# Altium project Urukul.PrjPCB (part 10 of 11)

## Sheet LEDs.SchDoc: =DocumentName
size A4; DocumentNumber: 1; Revision: 0; SheetNumber: 5; SheetTotal: 20
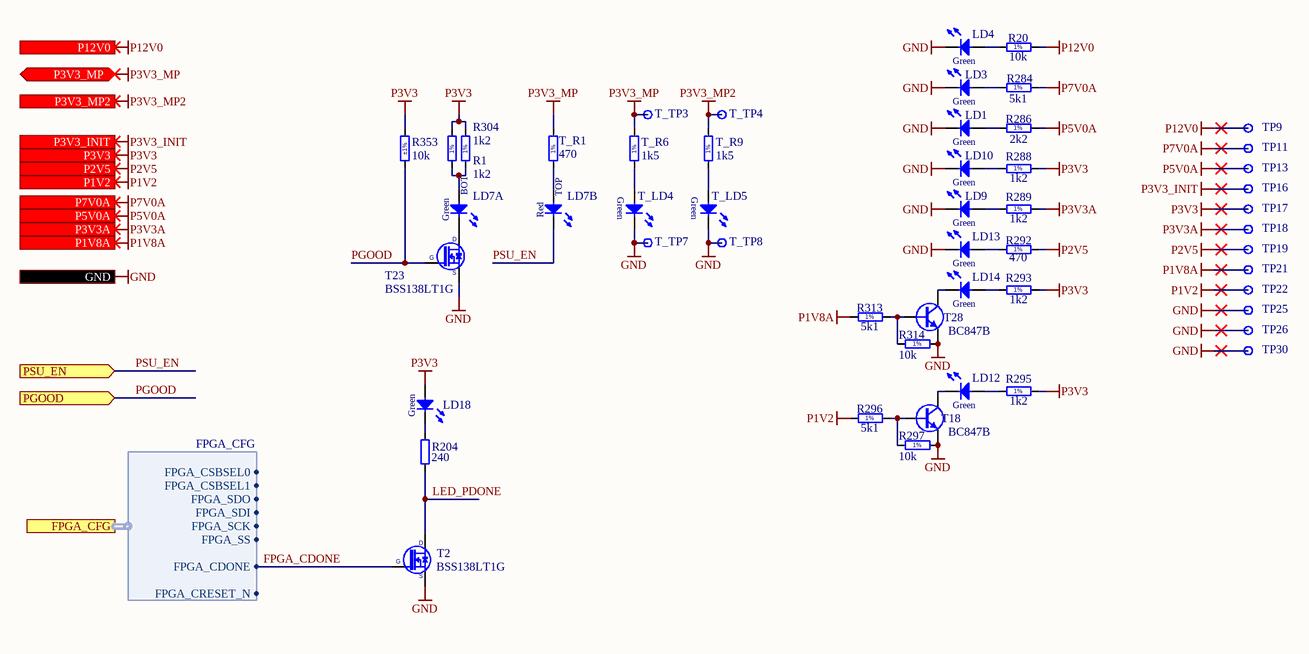
[diagram p19: LEDs.SchDoc]

### Parts
LD1  Green  [LED_KINGBRIGHT_KPH-1608CGCK]
LD3  Green  [LED_KINGBRIGHT_KPH-1608CGCK]
LD4  Green  [LED_KINGBRIGHT_KPH-1608CGCK]
LD7  Red/Green  [LED_DIALIGHT_571-0112F]  (value not drawn)  (parts A,B of 2)
LD9  Green  [LED_KINGBRIGHT_KPH-1608CGCK]
LD10  Green  [LED_KINGBRIGHT_KPH-1608CGCK]
LD12  Green  [LED_KINGBRIGHT_KPH-1608CGCK]
LD13  Green  [LED_KINGBRIGHT_KPH-1608CGCK]
LD14  Green  [LED_KINGBRIGHT_KPH-1608CGCK]
LD18  Green  [LED_AVAGO_HSME-C120]
R1  1k2  [RESC1608X55N]
R20  10k  [RESC1005X40N]
R204  240  [RESC1005X40N]
R284  5k1  [RESC1005X40N]
R286  2k2  [RESC1005X40N]
R288  1k2  [RESC1608X55N]
R289  1k2  [RESC1608X55N]
R292  470  [RESC1005X40N]
R293  1k2  [RESC1608X55N]
R295  1k2  [RESC1608X55N]
R296  5k1  [RESC1005X40N]
R297  10k  [RESC1005X40N]
R304  1k2  [RESC1608X55N]
R313  5k1  [RESC1005X40N]
R314  10k  [RESC1005X40N]
R353  10k  Tolerance: ±1%  [RESC1005X40N]
T2  BSS138LT1G  [SOT95P240X110-3N]
T18  BC847B  [SOT95P230X110-3N]
T23  BSS138LT1G  [SOT95P240X110-3N]
T28  BC847B  [SOT95P230X110-3N]
T_LD4  Green  [LED_KINGBRIGHT_KPH-1608CGCK]  (value not drawn)
T_LD5  Green  [LED_KINGBRIGHT_KPH-1608CGCK]  (value not drawn)
T_R1  470  [RESC1005X40N]
T_R6  1k5  [RESC1608X55N]
T_R9  1k5  [RESC1608X55N]
T_TP3  Test Point  [TPS127]  (value not drawn)  (no BOM)
T_TP4  Test Point  [TPS127]  (value not drawn)  (no BOM)
T_TP7  Test Point  [TPS127]  (value not drawn)  (no BOM)
T_TP8  Test Point  [TPS127]  (value not drawn)  (no BOM)
TP9  Test Point  [TPS127]  (value not drawn)  (no BOM)
TP11  Test Point  [TPS127]  (value not drawn)  (no BOM)
TP13  Test Point  [TPS127]  (value not drawn)  (no BOM)
TP16  Test Point  [TPS127]  (value not drawn)  (no BOM)
TP17  Test Point  [TPS127]  (value not drawn)  (no BOM)
TP18  Test Point  [TPS127]  (value not drawn)  (no BOM)
TP19  Test Point  [TPS127]  (value not drawn)  (no BOM)
TP21  Test Point  [TPS127]  (value not drawn)  (no BOM)
TP22  Test Point  [TPS127]  (value not drawn)  (no BOM)
TP25  Test Point  [TPS127]  (value not drawn)  (no BOM)
TP26  Test Point  [TPS127]  (value not drawn)  (no BOM)
TP30  Test Point  [TPS127]  (value not drawn)  (no BOM)

### Ports
FPGA_CFG (harness FPGA_CFG), GND, P1V2 (out), P1V8A (out), P2V5 (out), P3V3 (out), P3V3_INIT (out), P3V3_MP2 (in), P3V3_MP (bidir), P3V3A (out), P5V0A (out), P7V0A (out), P12V0 (in), PGOOD (in), PSU_EN (in)

### Harnesses
FPGA_CFG: FPGA_CSBSEL0, FPGA_CSBSEL1, FPGA_SDO, FPGA_SDI, FPGA_SCK, FPGA_SS, FPGA_CDONE, FPGA_CRESET_N

### Nets
GND: LD1.1(C) LD3.1(C) LD4.1(C) LD9.1(C) LD10.1(C) LD13.1(C) R297.2 R314.2 T2.2(S) T18.2(E) T23.2(S) T28.2(E) T_LD4.1(C) T_LD5.1(C) T_TP7.1 T_TP8.1 TP25.1 TP26.1 TP30.1 ; port GND
P1V2: R296.1 TP22.1 ; port P1V2
P1V8A: R313.1 TP21.1 ; port P1V8A
P2V5: R292.1 TP19.1 ; port P2V5
P3V3: LD18.2(A) R1.2 R288.2 R293.2 R295.2 R304.2 R353.2 TP17.1 ; port P3V3
P3V3_INIT: TP16.1 ; port P3V3_INIT
P3V3_MP: T_R1.1 T_R6.2 T_TP3.1 ; port P3V3_MP
P3V3_MP2: T_R9.2 T_TP4.1 ; port P3V3_MP2
P3V3A: R289.2 TP18.1 ; port P3V3A
P5V0A: R286.2 TP13.1 ; port P5V0A
P7V0A: R284.2 TP11.1 ; port P7V0A
P12V0: R20.2 TP9.1 ; port P12V0
FPGA_CDONE: T2.1(G) ; port FPGA_CFG.FPGA_CDONE
LED_PDONE: R204.1 T2.3(D)
PGOOD: R353.1 T23.1(G) ; port PGOOD  [project net INT_I2C_OE]
PSU_EN: LD7.3(C) ; port PSU_EN
NetLD1_2: LD1.2(A) R286.1
NetLD3_2: LD3.2(A) R284.1
NetLD4_2: LD4.2(A) R20.1
NetLD7_1: LD7.1(C) T23.3(D)
NetLD7_2: LD7.2(A) R1.1 R304.1
NetLD7_4: LD7.4(A) T_R1.2
NetLD9_2: LD9.2(A) R289.1
NetLD10_2: LD10.2(A) R288.1
NetLD12_1: LD12.1(C) T18.3(C)
NetLD12_2: LD12.2(A) R295.1
NetLD13_2: LD13.2(A) R292.2
NetLD14_1: LD14.1(C) T28.3(C)
NetLD14_2: LD14.2(A) R293.1
NetLD18_1: LD18.1(C) R204.2
NetR296_2: R296.2 R297.1 T18.1(B)
NetR313_2: R313.2 R314.1 T28.1(B)
NetT_LD4_2: T_LD4.2(A) T_R6.1
NetT_LD5_2: T_LD5.2(A) T_R9.1

### Notes on the sheet
- Filename:
- Project:
- SINARA
  LOGO
  TBD
- Originally released by:
- Last modified by:
- Last reviewed by:
- Size:
- Version:
- Last mod. date :
- Sheet:
- A4
- Copyright =P_copyright_owner
  This source describes Open Hardware and is licensed under the CERN-OHL-W v1. You may redistribute and modify this documentation and make products using it under the terms of the CERN-OHL-W v1 (https:/cern.ch/cern-ohl). This documentation is distributed WITHOUT ANY EXPRESS OR IMPLIED WARRANTY, INCLUDING OF MERCHANTABILITY, SATISFACTORY QUALITY AND FITNESS FOR A PARTICULAR PURPOSE. Please see the CERN-OHL-W v1 for applicable conditions.
  As per CERN-OHL-W 1 section 4.1, should You produce hardware based on these sources, You must maintain the Source Location visible on the external case of the product you make using this documentation.
  Source location: =P_github_link
- Sinara Opern Hardware:
- https://github.com/sinara-hw
- (in symbol LED_DIALIGHT_571-0112F, part A) BOT; Green
- (in symbol LED_DIALIGHT_571-0112F, part B) TOP; Red
- (in symbol R0402_2K2_1%_0.0625W_100PPM) 1%
- (in symbol R0402_5K1_1%_0.0625W_100PPM) 1%
- (in symbol R0402_10K_1%_0.0625W_100PPM) 1%
- (in symbol R0402_470R_1%_0.0625W_100PPM) 1%
- (in symbol R0603_1K2_1%_0.1W_100PPM) 1%
- (in symbol R0603_1K5_1%_0.1W_100PPM) 1%

### Library data of the parts
LD1 LD3 LD4 LD9 LD10 LD12-LD14 T_LD4 T_LD5 = LED_KINGBRIGHT_KPH-1608CGCK: LED Green 1C 2A; Part Description: SMD Green LED, Case 1.6mmX0.8mm(0603), 0.65mm Thickness; PressFit: No; Bonding: No; Part Number: LED_KINGBRIGHT_KPH-1608CGCK; Component Kind: Standard; Component Type: Standard; Color: Green; PackageDescription: SMT Green LED, Case 0603, Body L 1.6 x W 0.8mm H 0.65mm; Manufacturer: KINGBRIGHT; Manufacturer Part Number: KPH-1608CGCK; Pin Count: 2; Mounted: Yes; Socket: No; SMD: Yes; Sense: No; ComponentHeight: 0.65mm; HelpURL: \\cern.ch\dfs\Applications\Altium\Datasheets\LED_KINGBRIGHT_KPH-1608CGCK.pdf; Author: CERN DEM JLC
  LD1 LD3 LD4 LD9 LD10 LD12-LD14: CreateDate: 03/07/2017; LatestRevisionDate: 03/07/2017
  T_LD4 T_LD5: CreateDate: 03.07.2017; LatestRevisionDate: 03.07.2017
LD7 = LED_DIALIGHT_571-0112F: 2x LED  Botom Green, Top Red; Part Description: Dual 2mm  LEDs, Red Top,Green Bot, CBI® Circuit Board Indicator (Without positioning pins); PressFit: No; Bonding: No; Part Number: LED_DIALIGHT_571-0112F; Component Kind: Standard; Component Type: Standard; Color: Red/Green; PackageDescription: 2x 2mm LED (Top: Red, Bot: Green) PCB Edge Mounting (Without positioning pins) DIALIGHT 571 Serie; Manufacturer: DIALIGHT; Manufacturer Part Number: 571-0112F; Pin Count: 4; Mounted: Yes; Socket: No; SMD: No; Sense: No; ComponentHeight: 8.6mm; HelpURL: \\cern.ch\dfs\Applications\Altium\Datasheets\LED_DIALIGHT_571-0112F.pdf; Author: CERN DEM JLC; CreateDate: 09.11.2009; LatestRevisionDate: 17.03.2010
LD18 = LED_AVAGO_HSME-C120: LED Green 1C 2A; Part Description: High Performance Right Angle Chip Green LED; Manufacturer: AVAGO TECHNOLOGIES; PressFit: No; Bonding: No; Part Number: LED_AVAGO_HSME-C120; Component Kind: Standard; Component Type: Standard; Color: Green; PackageDescription: Green Chip LED, 2-Leads, Body 1.7x1.1mm, Side Emitting Package; Manufacturer Part Number: HSME-C120; Pin Count: 2; Mounted: Yes; Socket: No; SMD: Yes; Sense: No; ComponentHeight: 0.7mm; HelpURL: \\cern.ch\dfs\Applications\Altium\Datasheets\LED_AVAGO_HSME-C120.pdf; ComponentLink1URL: \\cern.ch\dfs\Applications\Altium\Datasheets\LED_AVAGO_HSME-C110_DESIGN-GUIDE.pdf; ComponentLink1Description: Design Guide; Author: CERN DEM JMW; CreateDate: 22.07.2009; LatestRevisionDate: 20.06.2012
R1 R288 R289 R293 R295 R304 = R0603_1K2_1%_0.1W_100PPM: as R130 on sheet Power_main_DCDC; Part Number: R0603_1K2_1%_0.1W_100PPM; Component Kind: Standard; Component Type: Standard; Pin Count: 2; Value: 1k2; Status: Preferred; Tolerance: ±1%; Manufacturer Part Number: R0603_1K2_1%_0.1W_100PPM; Case: 0603; Mounted: Yes; Sense: No; Socket: No; SMD: Yes; Manufacturer1 Example: NIC COMPONENT; Manufacturer1 ComponentHeight: 0.55mm; HelpURL: \\cern.ch\dfs\Applications\Altium\Datasheets\R0603_NIC_NRC.pdf; Author: CERN DEM JLC; CreateDate: 03.12.2007; LatestRevisionDate: 13.03.2008
R20 R297 R314 R353 = R0402_10K_1%_0.0625W_100PPM: as T_R31-T_R34 on sheet Power-up_delay; Part Number: R0402_10K_1%_0.0625W_100PPM; Component Kind: Standard; Component Type: Standard; Pin Count: 2; Value: 10k; Status: Not Recommended; Power: 0.0625W; Manufacturer Part Number: R0402_10K_1%_0.0625W_100PPM; Case: 0402; Mounted: Yes; Sense: No; Socket: No; SMD: Yes; Manufacturer1 Example: YAGEO PHYCOMP; Manufacturer1 ComponentHeight: 0.4mm; HelpURL: \\cern.ch\dfs\Applications\Altium\Datasheets\R0402_Phycomp_RC0402.pdf; Author: CERN DEM JLC; CreateDate: 03.12.2007; LatestRevisionDate: 17.10.2012
  R20 R297 R314: Tolerance: ±1%
R204 = R0402_240R_1%_0.0625W_100PPM: as R87 on sheet Power_main_DCDC; Part Number: R0402_240R_1%_0.0625W_100PPM; Component Kind: Standard; Component Type: Standard; Pin Count: 2; Value: 240; Status: Not Recommended; Power: 0.0625W; Tolerance: ±1%; Manufacturer Part Number: R0402_240R_1%_0.0625W_100PPM; Case: 0402; Mounted: Yes; Sense: No; Socket: No; SMD: Yes; Manufacturer1 Example: YAGEO PHYCOMP; Manufacturer1 ComponentHeight: 0.4mm; HelpURL: \\cern.ch\dfs\Applications\Altium\Datasheets\R0402_Phycomp_RC0402.pdf; Author: CERN DEM JLC; CreateDate: 03.12.2007; LatestRevisionDate: 17.10.2012
R284 R296 R313 = R0402_5K1_1%_0.0625W_100PPM: as R51 on sheet Power_main_DCDC; Part Number: R0402_5K1_1%_0.0625W_100PPM; Component Kind: Standard; Component Type: Standard; Pin Count: 2; Value: 5k1; Status: Not Recommended; Power: 0.0625W; Tolerance: ±1%; Manufacturer Part Number: R0402_5K1_1%_0.0625W_100PPM; Case: 0402; Mounted: Yes; Sense: No; Socket: No; SMD: Yes; Manufacturer1 Example: YAGEO PHYCOMP; Manufacturer1 ComponentHeight: 0.4mm; HelpURL: \\cern.ch\dfs\Applications\Altium\Datasheets\R0402_Phycomp_RC0402.pdf; Author: CERN DEM JLC; CreateDate: 03.12.2007; LatestRevisionDate: 17.10.2012
R286 = R0402_2K2_1%_0.0625W_100PPM: as R132 on sheet Power_main_DCDC; Part Number: R0402_2K2_1%_0.0625W_100PPM; Component Kind: Standard; Component Type: Standard; Pin Count: 2; Value: 2k2; Status: Not recommended; Power: 0.0625W; Tolerance: ±1%; Manufacturer Part Number: R0402_2K2_1%_0.0625W_100PPM; Case: 0402; Mounted: Yes; Socket: No; SMD: Yes; Manufacturer1 Example: YAGEO PHYCOMP; Manufacturer1 ComponentHeight: 0.4mm; HelpURL: \\cern.ch\dfs\Applications\Altium\Datasheets\R0402_Phycomp_RC0402.pdf; Author: CERN DEM JLC; CreateDate: 2007-12-03; LatestRevisionDate: 2012-10-17
R292 T_R1 = R0402_470R_1%_0.0625W_100PPM: Resistor - 1%; Part Description: General Purpose Thick Film Chip Resistor; Manufacturer: GENERIC; Manufacturer1 Part Number: 232270674701L; TC: ±100ppm/°C; PressFit: No; Part Number: R0402_470R_1%_0.0625W_100PPM; Component Kind: Standard; Component Type: Standard; Pin Count: 2; Value: 470; Status: Not Recommended; Power: 0.0625W; Tolerance: ±1%; Manufacturer Part Number: R0402_470R_1%_0.0625W_100PPM; Case: 0402; Mounted: Yes; Sense: No; Socket: No; SMD: Yes; Manufacturer1 Example: YAGEO PHYCOMP; Manufacturer1 ComponentHeight: 0.4mm; HelpURL: \\cern.ch\dfs\Applications\Altium\Datasheets\R0402_Phycomp_RC0402.pdf; Author: CERN DEM JLC; CreateDate: 03.12.2007; LatestRevisionDate: 17.10.2012
T2 = BSS138LT1G: as T3 on sheet Power_main_DCDC; Part Number: BSS138LT1G; Component Kind: Standard; Component Type: Standard; Device: BSS138LT1G; PackageDescription: SOT23 3-Leads, Pitch 0.95mm - Body 1.4x3mm, IPC Medium Density; Manufacturer Part Number: BSS138LT1G; Pin Count: 3; Case: SOT23-3; Mounted: Yes; Socket: No; SMD: Yes; Sense: No; ComponentHeight: 1.11mm; HelpURL: \\cern.ch\dfs\Applications\Altium\Datasheets\BSS138LT1G.pdf; Author: CERN DEM JLC; CreateDate: 23.03.2009; LatestRevisionDate: 23.03.2009
T18 T28 = BC847B: as T13 on sheet Power_main_DCDC; Part Number: BC847B; Component Kind: Standard; Component Type: Standard; Device: BC847B; PackageDescription: SOT23, 3 pin, Pitch 0.95mm - 1.3mm W X 2.9mm L X 1.1mm H, IPC Medium Density; Manufacturer Part Number: BC847B; Pin Count: 3; Case: SOT23-3; Mounted: Yes; Socket: No; SMD: Yes; Sense: No; ComponentHeight: 1.1mm; HelpURL: \\cern.ch\dfs\Applications\Altium\Datasheets\BC847B.pdf; Author: CERN DEM JLC; CreateDate: 14.06.2011; LatestRevisionDate: 14.06.2011
T23 = BSS138LT1G: as T_T2-T_T5 on sheet Power-up_delay; Part Number: BSS138LT1G; Component Kind: Standard; Component Type: Standard; Device: BSS138LT1G; PackageDescription: SOT23, 0.95mm Pitch; 3 Pin, 1.40mm W X 3.00mm L X 1.10mm H body, IPC Medium Density; Manufacturer Part Number: BSS138L; Pin Count: 3; Case: SOT23-3; Mounted: Yes; Socket: No; SMD: Yes; Sense: No; ComponentHeight: 1.11mm; HelpURL: \\cern.ch\dfs\Applications\Altium\Datasheets\BSS138LT1G.pdf; Author: CERN DEM JLC; CreateDate: 23.03.2009; LatestRevisionDate: 25.05.2022
T_R6 T_R9 = R0603_1K5_1%_0.1W_100PPM: as R80 on sheet Power_main_DCDC; Part Number: R0603_1K5_1%_0.1W_100PPM; Component Kind: Standard; Component Type: Standard; Pin Count: 2; Value: 1k5; Status: Preferred; Tolerance: ±1%; Manufacturer Part Number: R0603_1K5_1%_0.1W_100PPM; Case: 0603; Mounted: Yes; Sense: No; Socket: No; SMD: Yes; Manufacturer1 Example: NIC COMPONENT; Manufacturer1 ComponentHeight: 0.55mm; HelpURL: \\cern.ch\dfs\Applications\Altium\Datasheets\R0603_NIC_NRC.pdf; Author: CERN DEM JLC; CreateDate: 03.12.2007; LatestRevisionDate: 13.03.2008
T_TP3 T_TP4 T_TP7 T_TP8 TP9 TP11 TP13 TP16-TP19 TP21 TP22 TP25 TP26 TP30 = SMD_PAD_1.27X1.27MM: as TP5-TP8 on sheet Power_main_DCDC; Part Number: SMD_PAD_1.27X1.27MM; Component Type: Standard (No BOM); Pin Count: 1; Family: Test Point; Socket: No; SMD: Yes; Sense: No; Status: None; ComponentHeight: 0mm; HelpURL: Undefined; Author: CERN DEM JLC; CreateDate: 12.01.2008; LatestRevisionDate: 12.01.2008; PackageDescription: 1.27mm x 1.27mm PCB Copper Area (SMD Test Point)

## Nets that join several sheets
GND: CPCIS_Connectors_P1_P6 (55 pins), DIOT_signal_routing (T_C22.1 T_C23.1 T_IC8.4), EEM_Connectors (34 pins), Temperature_monitoring (5 pins), Mechanical (34 pins), FP_Connectors (52 pins), CLK_INPUT (68 pins), Urukul_FPGA_Supply (43 pins), U_DDS_OUT_channel0 (60 pins), U_DDS_OUT_channel1 (60 pins), U_DDS_OUT_channel2 (60 pins), U_DDS_OUT_channel3 (60 pins), U_DDS_channel0 (112 pins), U_DDS_channel1 (112 pins), U_DDS_channel2 (112 pins), U_DDS_channel3 (112 pins), Urukul_FPGA (10 pins), CLK_SYNC (19 pins), Urukul_FPGA_Config (24 pins), Urukul_FPGA_LVDS (T16.2), I2C_switch (6 pins), Power_Supplies (T_C1.1 T_C2.2 T_IC1.2 T_R7.1), Power-up_delay (9 pins), Power_main_DCDC (100 pins), LEDs (19 pins)
P1V2: Urukul_FPGA_Supply (16 pins), Power_main_DCDC (5 pins), LEDs (R296.1 TP22.1)
P1V8A: CLK_INPUT (R151.1 R164.1), U_DDS_channel0 (6 pins), U_DDS_channel1 (6 pins), U_DDS_channel2 (6 pins), U_DDS_channel3 (6 pins), CLK_SYNC (R150.1), Power_main_DCDC (6 pins), LEDs (R313.1 TP21.1)
P2V5: Urukul_FPGA_Supply (11 pins), Power_main_DCDC (5 pins), LEDs (R292.1 TP19.1)
P3V3: Urukul_FPGA_Supply (22 pins), Urukul_FPGA (12 pins), CLK_SYNC (L8.2 L13.2), Urukul_FPGA_Config (T_R90.2 T_R91.2 T_R92.2 T_R93.2), Urukul_FPGA_LVDS (LD19.2), I2C_switch (8 pins), Power_main_DCDC (8 pins), LEDs (8 pins)
P3V3_INIT: Urukul_FPGA_Supply (C5.2 U1.N13), Power_main_DCDC (6 pins), LEDs (TP16.1)
P3V3_MP: DIOT_signal_routing (T_C22.2 T_C23.2 T_IC8.1 T_IC8.8), EEM_Connectors (5 pins), Temperature_monitoring (T_C8.2 T_IC6.8), Urukul_FPGA_Config (14 pins), I2C_switch (T_C24.2 T_IC9.8), Power_Supplies (T_R2.2 T_R8.2), Power-up_delay (6 pins), LEDs (T_R1.1 T_R6.2 T_TP3.1)
P3V3_MP2: EEM_Connectors (5 pins), I2C_switch (T_C9.2 T_IC16.8), LEDs (T_R9.2 T_TP4.1)
P3V3A: CLK_INPUT (L10.2 L14.2 R16.1 T1.2), U_DDS_channel0 (L15A.2 L18A.2), U_DDS_channel1 (L15B.2 L18B.2), U_DDS_channel2 (L15C.2 L18C.2), U_DDS_channel3 (L15D.2 L18D.2), Power_main_DCDC (6 pins), LEDs (R289.2 TP18.1)
P5V0A: U_DDS_OUT_channel0 (L6A.2 L7A.1), U_DDS_OUT_channel1 (L6B.2 L7B.1), U_DDS_OUT_channel2 (L6C.2 L7C.1), U_DDS_OUT_channel3 (L6D.2 L7D.1), Power_main_DCDC (6 pins), LEDs (R286.2 TP13.1)
P7V0A: U_DDS_OUT_channel0 (C12A.2 C27A.2 R137A.1), U_DDS_OUT_channel1 (C12B.2 C27B.2 R137B.1), U_DDS_OUT_channel2 (C12C.2 C27C.2 R137C.1), U_DDS_OUT_channel3 (C12D.2 C27D.2 R137D.1), Power_main_DCDC (7 pins), LEDs (R284.2 TP11.1)
P12V0: CPCIS_Connectors_P1_P6 (7 pins), EEM_Connectors (T_J1.28 T_J1.29 T_J2.28 T_J2.29), Power_Supplies (T_C1.2 T_IC1.1 T_R4.1), Power-up_delay (T_R29.1), Power_main_DCDC (13 pins), LEDs (R20.2 TP9.1)
AFE_PWR_EN: Urukul_FPGA (U1.H16), Power_main_DCDC (R282.1)
ATT_CLK: U_DDS_OUT_channel0 (IC3A.21), U_DDS_OUT_channel1 (IC3B.21), U_DDS_OUT_channel2 (IC3C.21), U_DDS_OUT_channel3 (IC3D.21), Urukul_FPGA (U1.B3)
ATT_LE0: U_DDS_OUT_channel0 (IC3A.22), Urukul_FPGA (U1.D13)
ATT_LE1: U_DDS_OUT_channel1 (IC3B.22), Urukul_FPGA (U1.C11)
ATT_LE2: U_DDS_OUT_channel2 (IC3C.22), Urukul_FPGA (U1.D4)
ATT_LE3: U_DDS_OUT_channel3 (IC3D.22), Urukul_FPGA (U1.A2)
ATT_RSTn: U_DDS_OUT_channel0 (IC3A.20), U_DDS_OUT_channel1 (IC3B.20), U_DDS_OUT_channel2 (IC3C.20), U_DDS_OUT_channel3 (IC3D.20), Urukul_FPGA (U1.D8)
ATT_S_IN0: U_DDS_OUT_channel0 (IC3A.24), Urukul_FPGA (U1.C13)
ATT_S_IN1: U_DDS_OUT_channel1 (IC3B.24), Urukul_FPGA (U1.C12)
ATT_S_IN2: U_DDS_OUT_channel2 (IC3C.24), Urukul_FPGA (U1.C5)
ATT_S_IN3: U_DDS_OUT_channel3 (IC3D.24), Urukul_FPGA (U1.A1)
ATT_S_OUT0: U_DDS_OUT_channel0 (R100A.1), Urukul_FPGA (U1.C14)
ATT_S_OUT1: U_DDS_OUT_channel1 (R100B.1), Urukul_FPGA (U1.E11)
ATT_S_OUT2: U_DDS_OUT_channel2 (R100C.1), Urukul_FPGA (U1.C4)
ATT_S_OUT3: U_DDS_OUT_channel3 (R100D.1), Urukul_FPGA (U1.F9)
BP_CLK.CLK_N: CPCIS_Connectors_P1_P6 (T_J4.F4), CLK_INPUT (R86.1)
BP_CLK.CLK_P: CPCIS_Connectors_P1_P6 (T_J4.E4), CLK_INPUT (R66.1)
BP_I2C.SCL: CPCIS_Connectors_P1_P6 (T_D2.3 T_J4.B2), DIOT_signal_routing (T_IC8.6)
BP_I2C.SDA: CPCIS_Connectors_P1_P6 (T_D2.1 T_J4.C2), DIOT_signal_routing (T_IC8.7)
BP_IO.LVDS_N0: CPCIS_Connectors_P1_P6 (T_J4.E3), DIOT_signal_routing (T_R51.1)
BP_IO.LVDS_N1: CPCIS_Connectors_P1_P6 (T_J4.B3), DIOT_signal_routing (T_R52.1)
BP_IO.LVDS_N2: CPCIS_Connectors_P1_P6 (T_J4.C4), DIOT_signal_routing (T_R53.1)
BP_IO.LVDS_N3: CPCIS_Connectors_P1_P6 (T_J4.L4), DIOT_signal_routing (T_R54.1)
BP_IO.LVDS_N4: CPCIS_Connectors_P1_P6 (T_J4.I4), DIOT_signal_routing (T_R55.1)
BP_IO.LVDS_N5: CPCIS_Connectors_P1_P6 (T_J4.K5), DIOT_signal_routing (T_R56.1)
BP_IO.LVDS_N6: CPCIS_Connectors_P1_P6 (T_J4.H5), DIOT_signal_routing (T_R57.1)
BP_IO.LVDS_N7: CPCIS_Connectors_P1_P6 (T_J4.F6), DIOT_signal_routing (T_R58.1)
BP_IO.LVDS_N8: CPCIS_Connectors_P1_P6 (T_J4.C6), DIOT_signal_routing (T_R59.1)
BP_IO.LVDS_N9: CPCIS_Connectors_P1_P6 (T_J4.L6), DIOT_signal_routing (T_R60.1)
BP_IO.LVDS_N10: CPCIS_Connectors_P1_P6 (T_J4.I6), DIOT_signal_routing (T_R61.1)
BP_IO.LVDS_N11: CPCIS_Connectors_P1_P6 (T_J5.E1), DIOT_signal_routing (T_R62.1)
BP_IO.LVDS_N12: CPCIS_Connectors_P1_P6 (T_J5.B1), DIOT_signal_routing (T_R63.1)
BP_IO.LVDS_N13: CPCIS_Connectors_P1_P6 (T_J5.K1), DIOT_signal_routing (T_R64.1)
BP_IO.LVDS_N14: CPCIS_Connectors_P1_P6 (T_J5.H1), DIOT_signal_routing (T_R65.1)
BP_IO.LVDS_N15: CPCIS_Connectors_P1_P6 (T_J4.F2), DIOT_signal_routing (T_R66.2)
BP_IO.LVDS_P0: CPCIS_Connectors_P1_P6 (T_J4.D3), DIOT_signal_routing (T_R35.1)
BP_IO.LVDS_P1: CPCIS_Connectors_P1_P6 (T_J4.A3), DIOT_signal_routing (T_R36.1)
BP_IO.LVDS_P2: CPCIS_Connectors_P1_P6 (T_J4.B4), DIOT_signal_routing (T_R37.1)
BP_IO.LVDS_P3: CPCIS_Connectors_P1_P6 (T_J4.K4), DIOT_signal_routing (T_R38.1)
BP_IO.LVDS_P4: CPCIS_Connectors_P1_P6 (T_J4.H4), DIOT_signal_routing (T_R39.1)
BP_IO.LVDS_P5: CPCIS_Connectors_P1_P6 (T_J4.J5), DIOT_signal_routing (T_R40.1)
BP_IO.LVDS_P6: CPCIS_Connectors_P1_P6 (T_J4.G5), DIOT_signal_routing (T_R41.1)
BP_IO.LVDS_P7: CPCIS_Connectors_P1_P6 (T_J4.E6), DIOT_signal_routing (T_R42.1)
BP_IO.LVDS_P8: CPCIS_Connectors_P1_P6 (T_J4.B6), DIOT_signal_routing (T_R43.1)
BP_IO.LVDS_P9: CPCIS_Connectors_P1_P6 (T_J4.K6), DIOT_signal_routing (T_R44.1)
BP_IO.LVDS_P10: CPCIS_Connectors_P1_P6 (T_J4.H6), DIOT_signal_routing (T_R45.1)
BP_IO.LVDS_P11: CPCIS_Connectors_P1_P6 (T_J5.D1), DIOT_signal_routing (T_R46.1)
BP_IO.LVDS_P12: CPCIS_Connectors_P1_P6 (T_J5.A1), DIOT_signal_routing (T_R47.1)
BP_IO.LVDS_P13: CPCIS_Connectors_P1_P6 (T_J5.J1), DIOT_signal_routing (T_R48.1)
BP_IO.LVDS_P14: CPCIS_Connectors_P1_P6 (T_J5.G1), DIOT_signal_routing (T_R49.1)
BP_IO.LVDS_P15: CPCIS_Connectors_P1_P6 (T_J4.E2), DIOT_signal_routing (T_R50.2)
CK_SMA_IN: FP_Connectors (J2.1), CLK_INPUT (C196.1)
CLK_DIV: CLK_INPUT (R155.1), Urukul_FPGA (U1.P6)
CLK_DRTIO: CLK_INPUT (TR9.3), Urukul_FPGA (R67.2 U1.R9)
CSN: U_DDS_channel0 (IC2A.70 IC13A.61), Urukul_FPGA (U1.B10)
CSN: U_DDS_channel1 (IC2B.70 IC13B.61), Urukul_FPGA (U1.M15)
CSN: U_DDS_channel2 (IC2C.70 IC13C.61), Urukul_FPGA (U1.D6)
CSN: U_DDS_channel3 (IC2D.70 IC13D.61), Urukul_FPGA (U1.R15)
DAC_OUT_N: U_DDS_OUT_channel0 (R8A.1 R38A.1 TR1A.4 TR8A.3), U_DDS_channel0 (R78A.2 R91A.2)
DAC_OUT_N: U_DDS_OUT_channel1 (R8B.1 R38B.1 TR1B.4 TR8B.3), U_DDS_channel1 (R78B.2 R91B.2)
DAC_OUT_N: U_DDS_OUT_channel2 (R8C.1 R38C.1 TR1C.4 TR8C.3), U_DDS_channel2 (R78C.2 R91C.2)
DAC_OUT_N: U_DDS_OUT_channel3 (R8D.1 R38D.1 TR1D.4 TR8D.3), U_DDS_channel3 (R78D.2 R91D.2)
DAC_OUT_P: U_DDS_OUT_channel0 (R8A.2 R54A.1 TR1A.6 TR8A.1), U_DDS_channel0 (R56A.2 R79A.2)
DAC_OUT_P: U_DDS_OUT_channel1 (R8B.2 R54B.1 TR1B.6 TR8B.1), U_DDS_channel1 (R56B.2 R79B.2)
DAC_OUT_P: U_DDS_OUT_channel2 (R8C.2 R54C.1 TR1C.6 TR8C.1), U_DDS_channel2 (R56C.2 R79C.2)
DAC_OUT_P: U_DDS_OUT_channel3 (R8D.2 R54D.1 TR1D.6 TR8D.1), U_DDS_channel3 (R56D.2 R79D.2)
DDS_CLK_N: CLK_INPUT (C58.1), U_DDS_channel3 (IC13D.28 R12D.2)
DDS_CLK_N: CLK_INPUT (C60.1), U_DDS_channel2 (IC13C.28 R12C.2)
DDS_CLK_N: CLK_INPUT (C88.1), U_DDS_channel1 (IC13B.28 R12B.2)
DDS_CLK_N: CLK_INPUT (C93.1), U_DDS_channel0 (IC13A.28 R12A.2)
DDS_CLK_P: CLK_INPUT (C57.1), U_DDS_channel3 (IC13D.27 R12D.1)
DDS_CLK_P: CLK_INPUT (C59.1), U_DDS_channel2 (IC13C.27 R12C.1)
DDS_CLK_P: CLK_INPUT (C62.1), U_DDS_channel1 (IC13B.27 R12B.1)
DDS_CLK_P: CLK_INPUT (C92.1), U_DDS_channel0 (IC13A.27 R12A.1)
DDS_CLKB_N: CLK_INPUT (C61.1), U_DDS_channel1 (IC2B.91 R10B.2)
DDS_CLKB_N: CLK_INPUT (C66.1), U_DDS_channel0 (IC2A.91 R10A.2)
DDS_CLKB_N: CLK_INPUT (C71.1), U_DDS_channel2 (IC2C.91 R10C.2)
DDS_CLKB_N: CLK_INPUT (C96.1), U_DDS_channel3 (IC2D.91 R10D.2)
DDS_CLKB_P: CLK_INPUT (C56.1), U_DDS_channel1 (IC2B.90 R10B.1)
DDS_CLKB_P: CLK_INPUT (C65.1), U_DDS_channel0 (IC2A.90 R10A.1)
DDS_CLKB_P: CLK_INPUT (C68.1), U_DDS_channel2 (IC2C.90 R10C.1)
DDS_CLKB_P: CLK_INPUT (C95.1), U_DDS_channel3 (IC2D.90 R10D.1)
DDS_I/O_RESET: U_DDS_channel0 (IC2A.71), U_DDS_channel1 (IC2B.71), U_DDS_channel2 (IC2C.71), U_DDS_channel3 (IC2D.71), Urukul_FPGA (U1.E14)
DDS_PLL_LOCK0: U_DDS_channel0 (IC2A.19), Urukul_FPGA (U1.E5)
DDS_PLL_LOCK1: U_DDS_channel1 (IC2B.19), Urukul_FPGA (U1.C10)
DDS_PLL_LOCK2: U_DDS_channel2 (IC2C.19), Urukul_FPGA (U1.P4)
DDS_PLL_LOCK3: U_DDS_channel3 (IC2D.19), Urukul_FPGA (U1.P16)
DDS_Profile.P00: U_DDS_channel0 (IC2A.54), Urukul_FPGA (U1.A15)
DDS_Profile.P01: U_DDS_channel1 (IC2B.54), Urukul_FPGA (U1.J14)
DDS_Profile.P02: U_DDS_channel2 (IC2C.54), Urukul_FPGA (U1.E9)
DDS_Profile.P03: U_DDS_channel3 (IC2D.54), Urukul_FPGA (U1.L12)
DDS_Profile.P10: U_DDS_channel0 (IC2A.53), Urukul_FPGA (U1.B13)
DDS_Profile.P11: U_DDS_channel1 (IC2B.53), Urukul_FPGA (U1.K14)
DDS_Profile.P12: U_DDS_channel2 (IC2C.53), Urukul_FPGA (U1.E6)
DDS_Profile.P13: U_DDS_channel3 (IC2D.53), Urukul_FPGA (U1.M13)
DDS_Profile.P20: U_DDS_channel0 (IC2A.52), Urukul_FPGA (U1.B14)
DDS_Profile.P21: U_DDS_channel1 (IC2B.52), Urukul_FPGA (U1.J10)
DDS_Profile.P22: U_DDS_channel2 (IC2C.52), Urukul_FPGA (U1.D7)
DDS_Profile.P23: U_DDS_channel3 (IC2D.52), Urukul_FPGA (U1.R14)
DDS_RESET0: U_DDS_channel0 (IC13A.59), Urukul_FPGA (R111.1)
DDS_RESET1: U_DDS_channel1 (IC13B.59), Urukul_FPGA (R115.1)
DDS_RESET2: U_DDS_channel2 (IC13C.59), Urukul_FPGA (R116.1)
DDS_RESET3: U_DDS_channel3 (IC13D.59), Urukul_FPGA (R139.1)
DDS_SCKI0: U_DDS_channel0 (IC2A.69 IC13A.64 R40A.2), Urukul_FPGA (U1.B8)
DDS_SCKI1: U_DDS_channel1 (IC2B.69 IC13B.64 R40B.2), Urukul_FPGA (U1.G11)
DDS_SCKI2: U_DDS_channel2 (IC2C.69 IC13C.64 R40C.2), Urukul_FPGA (U1.C3)
DDS_SCKI3: U_DDS_channel3 (IC2D.69 IC13D.64 R40D.2), Urukul_FPGA (U1.K13)
DDS_SDI0: U_DDS_channel0 (IC2A.67 IC13A.63 R41A.2), Urukul_FPGA (U1.A10)
DDS_SDI1: U_DDS_channel1 (IC2B.67 IC13B.63 R41B.2), Urukul_FPGA (U1.M16)
DDS_SDI2: U_DDS_channel2 (IC2C.67 IC13C.63 R41C.2), Urukul_FPGA (U1.A5)
DDS_SDI3: U_DDS_channel3 (IC2D.67 IC13D.63 R41D.2), Urukul_FPGA (U1.L14)
DDS_SDO0: U_DDS_channel0 (IC2A.68 IC13A.62), Urukul_FPGA (U1.A11)
DDS_SDO1: U_DDS_channel1 (IC2B.68 IC13B.62), Urukul_FPGA (U1.N16)
DDS_SDO2: U_DDS_channel2 (IC2C.68 IC13C.62), Urukul_FPGA (U1.D5)
DDS_SDO3: U_DDS_channel3 (IC2D.68 IC13D.62), Urukul_FPGA (U1.L13)
DDS_SYNC_CLK0: U_DDS_channel0 (IC2A.55), Urukul_FPGA (U1.B4), CLK_SYNC (R31.1)
DDS_SYNC_CLK_OUTEN: Urukul_FPGA (U1.N6), CLK_SYNC (IC4.3)
DDS_SYNC_CLKSEL: Urukul_FPGA (U1.N5), CLK_SYNC (R152.1)
DDS_SYNC_IN_N0: U_DDS_channel0 (IC2A.8), CLK_SYNC (IC9.4)
DDS_SYNC_IN_N1: U_DDS_channel1 (IC2B.8), CLK_SYNC (IC9.31)
DDS_SYNC_IN_N2: U_DDS_channel2 (IC2C.8), CLK_SYNC (IC9.25)
DDS_SYNC_IN_N3: U_DDS_channel3 (IC2D.8), CLK_SYNC (IC9.27)
DDS_SYNC_IN_P0: U_DDS_channel0 (IC2A.7), CLK_SYNC (IC9.5)
DDS_SYNC_IN_P1: U_DDS_channel1 (IC2B.7), CLK_SYNC (IC9.32)
DDS_SYNC_IN_P2: U_DDS_channel2 (IC2C.7), CLK_SYNC (IC9.26)
DDS_SYNC_IN_P3: U_DDS_channel3 (IC2D.7), CLK_SYNC (IC9.28)
DDS_SYNC_OUT_N0: U_DDS_channel0 (IC2A.10), CLK_SYNC (IC9.15 R68.2)
DDS_SYNC_OUT_P0: U_DDS_channel0 (IC2A.9), CLK_SYNC (IC9.14 R68.1)
DDS_SYNC_OUTEN: Urukul_FPGA (U1.N7), CLK_SYNC (IC16.3 R153.1)
DDS_UPDATE0: U_DDS_channel0 (IC2A.59 IC13A.60), Urukul_FPGA (U1.B12)
DDS_UPDATE1: U_DDS_channel1 (IC2B.59 IC13B.60), Urukul_FPGA (U1.L16)
DDS_UPDATE2: U_DDS_channel2 (IC2C.59 IC13C.60), Urukul_FPGA (U1.C6)
DDS_UPDATE3: U_DDS_channel3 (IC2D.59 IC13D.60), Urukul_FPGA (U1.M14)
EEM0_I2C.SCL: DIOT_signal_routing (T_IC8.3), EEM_Connectors (T_D1.3 T_IC2.1 T_IC3.6 T_J1.27), Temperature_monitoring (T_IC6.2), Urukul_FPGA_Config (T_IC10.2), I2C_switch (T_IC9.6)
EEM0_I2C.SDA: DIOT_signal_routing (T_IC8.2), EEM_Connectors (T_D1.1 T_IC2.3 T_IC3.5 T_J1.26), Temperature_monitoring (T_IC6.1), Urukul_FPGA_Config (T_IC10.1), I2C_switch (T_IC9.7)
EEM0_INT_I2C.SCL: Urukul_FPGA (U1.T6), I2C_switch (T_IC9.3 T_R68.1)
EEM0_INT_I2C.SDA: Urukul_FPGA (U1.T7), I2C_switch (T_IC9.2 T_R67.1)
EEM1_I2C.SCL: EEM_Connectors (T_D1.6 T_IC4.1 T_IC5.6 T_J2.27), I2C_switch (T_IC16.6)
EEM1_I2C.SDA: EEM_Connectors (T_D1.4 T_IC4.3 T_IC5.5 T_J2.26), I2C_switch (T_IC16.7)
EEM1_INT_I2C.SCL: Urukul_FPGA (U1.R4), I2C_switch (T_IC16.3 T_R12.1)
EEM1_INT_I2C.SDA: Urukul_FPGA (U1.R5), I2C_switch (T_IC16.2 T_R11.1)
EEM_IO.LVDS_N0: DIOT_signal_routing (T_R51.2), EEM_Connectors (T_J1.3), Urukul_FPGA_LVDS (R333.2 R334.1)
EEM_IO.LVDS_N1: DIOT_signal_routing (T_R52.2), EEM_Connectors (T_J1.6), Urukul_FPGA_LVDS (R83.1 R85.2)
EEM_IO.LVDS_N2: DIOT_signal_routing (T_R53.2), EEM_Connectors (T_J1.9), Urukul_FPGA_LVDS (R200.2 R203.1)
EEM_IO.LVDS_N3: DIOT_signal_routing (T_R54.2), EEM_Connectors (T_J1.12), Urukul_FPGA_LVDS (R207.2 R208.1)
EEM_IO.LVDS_N4: DIOT_signal_routing (T_R55.2), EEM_Connectors (T_J1.15), Urukul_FPGA_LVDS (R348.2 R349.1)
EEM_IO.LVDS_N5: DIOT_signal_routing (T_R56.2), EEM_Connectors (T_J1.18), Urukul_FPGA_LVDS (R213.2 R214.1)
EEM_IO.LVDS_N6: DIOT_signal_routing (T_R57.2), EEM_Connectors (T_J1.21), Urukul_FPGA_LVDS (R216.2 R217.1)
EEM_IO.LVDS_N7: DIOT_signal_routing (T_R58.2), EEM_Connectors (T_J1.24), CLK_SYNC (IC9.11), Urukul_FPGA_LVDS (R321.2 R322.1)
EEM_IO.LVDS_N8: DIOT_signal_routing (T_R59.2), EEM_Connectors (T_J2.3), CLK_SYNC (IC4.5), Urukul_FPGA_LVDS (R210.2 R211.1)
EEM_IO.LVDS_N9: DIOT_signal_routing (T_R60.2), EEM_Connectors (T_J2.6), CLK_SYNC (IC16.6), Urukul_FPGA_LVDS (R324.2 R325.1)
EEM_IO.LVDS_N10: DIOT_signal_routing (T_R61.2), EEM_Connectors (T_J2.9), Urukul_FPGA_LVDS (R327.2 R328.1)
EEM_IO.LVDS_N11: DIOT_signal_routing (T_R62.2), EEM_Connectors (T_J2.12), Urukul_FPGA_LVDS (R330.2 R331.1)
EEM_IO.LVDS_N12: DIOT_signal_routing (T_R63.2), EEM_Connectors (T_J2.15), Urukul_FPGA_LVDS (R336.2 R337.1)
EEM_IO.LVDS_N13: DIOT_signal_routing (T_R64.2), EEM_Connectors (T_J2.18), Urukul_FPGA_LVDS (R339.2 R340.1)
EEM_IO.LVDS_N14: DIOT_signal_routing (T_R65.2), EEM_Connectors (T_J2.21), Urukul_FPGA_LVDS (R342.2 R343.1)
EEM_IO.LVDS_N15: DIOT_signal_routing (T_R66.1), EEM_Connectors (T_J2.24), Urukul_FPGA_LVDS (R345.2 R346.1)
EEM_IO.LVDS_P0: DIOT_signal_routing (T_R35.2), EEM_Connectors (T_J1.2), Urukul_FPGA_LVDS (R334.2 R335.2)
EEM_IO.LVDS_P1: DIOT_signal_routing (T_R36.2), EEM_Connectors (T_J1.5), Urukul_FPGA_LVDS (R83.2 R199.2)
EEM_IO.LVDS_P2: DIOT_signal_routing (T_R37.2), EEM_Connectors (T_J1.8), Urukul_FPGA_LVDS (R203.2 R206.2)
EEM_IO.LVDS_P3: DIOT_signal_routing (T_R38.2), EEM_Connectors (T_J1.11), Urukul_FPGA_LVDS (R208.2 R209.2)
EEM_IO.LVDS_P4: DIOT_signal_routing (T_R39.2), EEM_Connectors (T_J1.14), Urukul_FPGA_LVDS (R349.2 R350.2)
EEM_IO.LVDS_P5: DIOT_signal_routing (T_R40.2), EEM_Connectors (T_J1.17), Urukul_FPGA_LVDS (R214.2 R215.2)
EEM_IO.LVDS_P6: DIOT_signal_routing (T_R41.2), EEM_Connectors (T_J1.20), Urukul_FPGA_LVDS (R217.2 R320.2)
EEM_IO.LVDS_P7: DIOT_signal_routing (T_R42.2), EEM_Connectors (T_J1.23), CLK_SYNC (IC9.10), Urukul_FPGA_LVDS (R322.2 R323.2)
EEM_IO.LVDS_P8: DIOT_signal_routing (T_R43.2), EEM_Connectors (T_J2.2), CLK_SYNC (IC4.6), Urukul_FPGA_LVDS (R211.2 R212.2)
EEM_IO.LVDS_P9: DIOT_signal_routing (T_R44.2), EEM_Connectors (T_J2.5), CLK_SYNC (IC16.5), Urukul_FPGA_LVDS (R325.2 R326.2)
EEM_IO.LVDS_P10: DIOT_signal_routing (T_R45.2), EEM_Connectors (T_J2.8), Urukul_FPGA_LVDS (R328.2 R329.2)
EEM_IO.LVDS_P11: DIOT_signal_routing (T_R46.2), EEM_Connectors (T_J2.11), Urukul_FPGA_LVDS (R331.2 R332.2)
EEM_IO.LVDS_P12: DIOT_signal_routing (T_R47.2), EEM_Connectors (T_J2.14), Urukul_FPGA_LVDS (R337.2 R338.2)
EEM_IO.LVDS_P13: DIOT_signal_routing (T_R48.2), EEM_Connectors (T_J2.17), Urukul_FPGA_LVDS (R340.2 R341.2)
EEM_IO.LVDS_P14: DIOT_signal_routing (T_R49.2), EEM_Connectors (T_J2.20), Urukul_FPGA_LVDS (R343.2 R344.2)
EEM_IO.LVDS_P15: DIOT_signal_routing (T_R50.1), EEM_Connectors (T_J2.23), Urukul_FPGA_LVDS (R346.2 R347.2)
FPGA_CDONE: Urukul_FPGA (T_R70.1 U1.M10), Urukul_FPGA_Config (T_J7.10), LEDs (T2.1)
FPGA_CFG.FPGA_CRESET_N: Urukul_FPGA (T_R71.1 U1.N11), Urukul_FPGA_Config (T_D7.2 T_IC14.4)
FPGA_CFG.FPGA_CSBSEL0: Urukul_FPGA (U1.K11), Urukul_FPGA_Config (T_R90.1 T_SW1.8)
FPGA_CFG.FPGA_CSBSEL1: Urukul_FPGA (U1.P13), Urukul_FPGA_Config (T_R91.1 T_SW1.7)
FPGA_CFG.FPGA_SCK: Urukul_FPGA (U1.R11), Urukul_FPGA_Config (T_IC12.10)
FPGA_CFG.FPGA_SDI: Urukul_FPGA (U1.P11), Urukul_FPGA_Config (T_IC12.6)
FPGA_CFG.FPGA_SDO: Urukul_FPGA (U1.P12), Urukul_FPGA_Config (T_IC12.3)
FPGA_CFG.FPGA_SS: Urukul_FPGA (U1.R12), Urukul_FPGA_Config (T_IC12.13)
GA0: CPCIS_Connectors_P1_P6 (T_R13.1), Power-up_delay (T_R31.1 T_T2.1)
GA1: CPCIS_Connectors_P1_P6 (T_R14.1), Power-up_delay (T_R32.1 T_T3.1)
GA2: CPCIS_Connectors_P1_P6 (T_R16.1), Power-up_delay (T_R33.1 T_T4.1)
GA3: CPCIS_Connectors_P1_P6 (T_R18.1), Power-up_delay (T_R34.1 T_T5.1)
IN_SEL: CLK_INPUT (R154.1), Urukul_FPGA (U1.P5)
INT_I2C_OE: I2C_switch (T_IC9.5 T_IC16.5), Power_main_DCDC (5 pins), LEDs (R353.1 T23.1)
LED0: FP_Connectors (R5.2 R27.2), Urukul_FPGA (U1.G13)
LED1: FP_Connectors (R28.1), Urukul_FPGA (U1.G14)
LED2: FP_Connectors (R7.2 R29.2), Urukul_FPGA (U1.F14)
LED3: FP_Connectors (R30.1), Urukul_FPGA (U1.F13)
LED4: FP_Connectors (R9.2 R43.2), Urukul_FPGA (U1.E13)
LED5: FP_Connectors (R44.1), Urukul_FPGA (U1.G12)
LED6: FP_Connectors (R13.2 R25.2), Urukul_FPGA (U1.H13)
LED7: FP_Connectors (R26.1), Urukul_FPGA (U1.F11)
Master_RESET: U_DDS_channel0 (IC2A.14), U_DDS_channel1 (IC2B.14), U_DDS_channel2 (IC2C.14), U_DDS_channel3 (IC2D.14), Urukul_FPGA (U1.C7)
MMCX_OSCn_SEL: CLK_INPUT (R165.1), Urukul_FPGA (U1.M8)
OSC_ENn: CLK_INPUT (T1.1), Urukul_FPGA (U1.T5)
OSK0: U_DDS_channel0 (IC2A.60), Urukul_FPGA (U1.A16)
OSK01: U_DDS_channel1 (IC2B.60), Urukul_FPGA (U1.H12)
OSK02: U_DDS_channel2 (IC2C.60), Urukul_FPGA (U1.E10)
OSK03: U_DDS_channel3 (IC2D.60), Urukul_FPGA (U1.J12)
PGOOD_FPGA: Urukul_FPGA_Config (T_IC13.1 T_IC14.2), Power_main_DCDC (11 pins)
PSU_EN: Temperature_monitoring (T_IC6.3), Power_Supplies (T_R8.1), Power-up_delay (T_IC7.1), Power_main_DCDC (5 pins), LEDs (LD7.3)
RAMP_CTL.DRCTL0: U_DDS_channel0 (IC2A.62), Urukul_FPGA (U1.B16)
RAMP_CTL.DRCTL1: U_DDS_channel1 (IC2B.62), Urukul_FPGA (U1.G16)
RAMP_CTL.DRCTL2: U_DDS_channel2 (IC2C.62), Urukul_FPGA (U1.C9)
RAMP_CTL.DRCTL3: U_DDS_channel3 (IC2D.62), Urukul_FPGA (U1.H11)
RAMP_CTL.DRHOLD0: U_DDS_channel0 (IC2A.63), Urukul_FPGA (U1.D14)
RAMP_CTL.DRHOLD1: U_DDS_channel1 (IC2B.63), Urukul_FPGA (U1.B9)
RAMP_CTL.DRHOLD2: U_DDS_channel2 (IC2C.63), Urukul_FPGA (U1.D10)
RAMP_CTL.DRHOLD3: U_DDS_channel3 (IC2D.63), Urukul_FPGA (U1.G10)
RAMP_CTL.DROVER0: U_DDS_channel0 (IC2A.61), Urukul_FPGA (U1.B15)
RAMP_CTL.DROVER1: U_DDS_channel1 (IC2B.61), Urukul_FPGA (U1.G15)
RAMP_CTL.DROVER2: U_DDS_channel2 (IC2C.61), Urukul_FPGA (U1.D9)
RAMP_CTL.DROVER3: U_DDS_channel3 (IC2D.61), Urukul_FPGA (U1.J11)
RF_OUT0: FP_Connectors (R180.2 TR5.3), U_DDS_OUT_channel0 (C50A.2 D2A.2 R192A.2)
RF_OUT1: FP_Connectors (R179.2 TR4.3), U_DDS_OUT_channel1 (C50B.2 D2B.2 R192B.2)
RF_OUT2: FP_Connectors (R181.2 TR6.3), U_DDS_OUT_channel2 (C50C.2 D2C.2 R192C.2)
RF_OUT3: FP_Connectors (R182.2 TR7.3), U_DDS_OUT_channel3 (C50D.2 D2D.2 R192D.2)
RFSW_CTRL0: U_DDS_OUT_channel0 (IC23A.2 R20A.2), Urukul_FPGA (U1.A7)
RFSW_CTRL1: U_DDS_OUT_channel1 (IC23B.2 R20B.2), Urukul_FPGA (U1.A6)
RFSW_CTRL2: U_DDS_OUT_channel2 (IC23C.2 R20C.2), Urukul_FPGA (U1.C8)
RFSW_CTRL3: U_DDS_OUT_channel3 (IC23D.2 R20D.2), Urukul_FPGA (U1.B6)
RSTn: CPCIS_Connectors_P1_P6 (T_R15.1), Power-up_delay (T_D6.1)
SERVMOD_3V3: CPCIS_Connectors_P1_P6 (T_R17.1 T_R19.2), DIOT_signal_routing (T_IC8.5)
SW0: Urukul_FPGA (U1.F15), Urukul_FPGA_Config (T_R96.1)
SW1: Urukul_FPGA (U1.F16), Urukul_FPGA_Config (T_R97.1)
SYNC_SMP_ERR0: U_DDS_channel0 (IC2A.12), Urukul_FPGA (U1.F7)
SYNC_SMP_ERR1: U_DDS_channel1 (IC2B.12), Urukul_FPGA (U1.D11)
SYNC_SMP_ERR2: U_DDS_channel2 (IC2C.12), Urukul_FPGA (U1.B5)
SYNC_SMP_ERR3: U_DDS_channel3 (IC2D.12), Urukul_FPGA (U1.P15)